# Altium schematic sheet 5_WG.SchDoc
size A3; DocumentNumber: 4; SheetNumber: 5; SheetTotal: 6
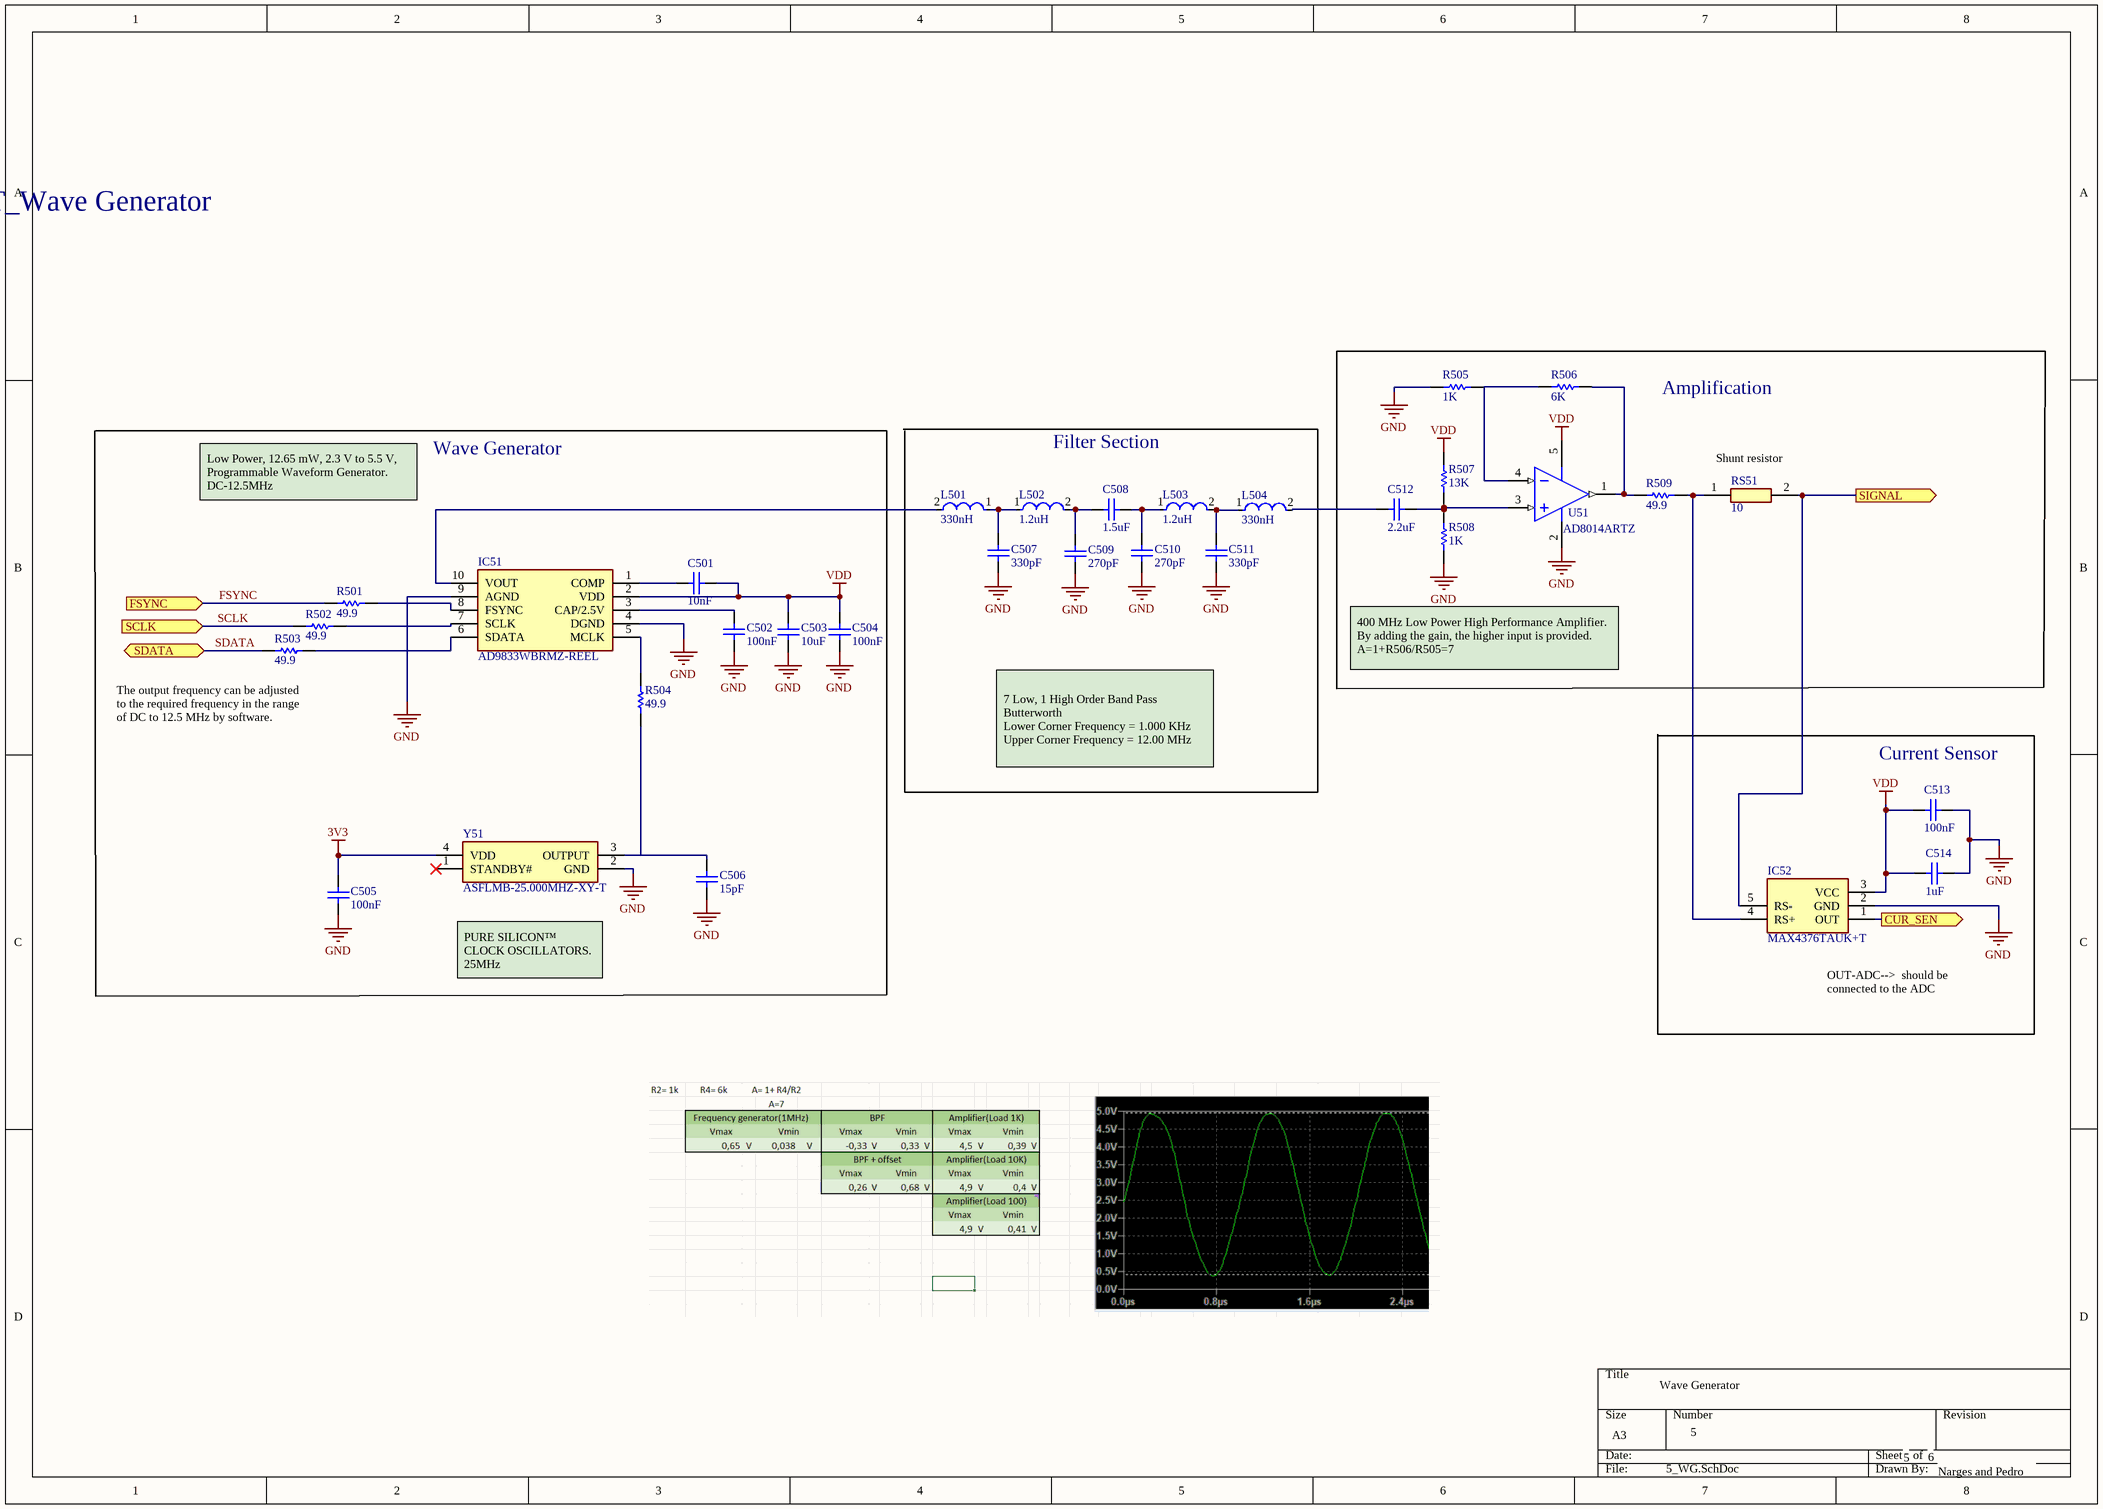
[diagram p0: 5_WG.SchDoc]

## Parts
C501  value 10nF  [CAPC1005X55X30LL05T10]  (hidden comment: generic)
C502  value 100nF  [CAPC1005X55X30LL05T10]  (hidden comment: generic)
C503  value 10uF  [FP-C0603C-CF-IPC_A]  (hidden comment: generic)
C504  value 100nF  [CAPC1005X55X30LL05T10]  (hidden comment: generic)
C505  value 100nF  [CAPC1005X55X30LL05T10]  (hidden comment: generic)
C506  value 15pF  [CAPC1005X55X30LL05T10]  (hidden comment: generic)
C507  value 330pF  [CAPC1005X55X30LL05T10]  (hidden comment: generic)
C508  value 1.5uF  [CAPC1005X55X30LL05T10]  (hidden comment: generic)
C509  value 270pF  [CAPC1005X55X30LL05T10]  (hidden comment: generic)
C510  value 270pF  [CAPC1005X55X30LL05T10]  (hidden comment: generic)
C511  value 330pF  [CAPC1005X55X30LL05T10]  (hidden comment: generic)
C512  value 2.2uF  [FP-C0603C-CF-IPC_A]  (hidden comment: generic)
C513  value 100nF  [CAPC1005X55X30LL05T10]  (hidden comment: generic)
C514  value 1uF  [CAPC1005X55X30LL05T10]  (hidden comment: generic)
IC51  AD9833WBRMZ-REEL  [ADI-RM-10_L]
IC52  MAX4376TAUK+T  [MAXM-U5+2_L]
L501  Inductance: 330nH  [IND_0402HL-821XJRU]  (hidden comment: LQW18AN10NG00D)
L502  Inductance: 1.2uH  [IND_0402HL-821XJRU]  (hidden comment: LQW18AN10NG00D)
L503  Inductance: 1.2uH  [IND_0402HL-821XJRU]  (hidden comment: LQW18AN10NG00D)
L504  Inductance: 330nH  [IND_0402HL-821XJRU]  (hidden comment: LQW18AN10NG00D)
R501  Resistance: 49.9  [RESC1608X55X25LL10T15]  (hidden comment: RC0603JR-070RL)
R502  Resistance: 49.9  [RESC1608X55X25LL10T15]  (hidden comment: RC0603JR-070RL)
R503  Resistance: 49.9  [RESC1608X55X25LL10T15]  (hidden comment: RC0603JR-070RL)
R504  Resistance: 49.9  [RESC1608X55X25LL10T15]  (hidden comment: RC0603JR-070RL)
R505  Resistance: 1K  [RESC1608X55X25LL10T15]  (hidden comment: RC0603JR-070RL)
R506  Resistance: 6K  [RESC1608X55X25LL10T15]  (hidden comment: RC0603JR-070RL)
R507  Resistance: 13K  [RESC1608X55X25LL10T15]  (hidden comment: RC0603JR-070RL)
R508  Resistance: 1K  [RESC1608X55X25LL10T15]  (hidden comment: RC0603JR-070RL)
R509  Resistance: 49.9  [RESC1608X55X25LL10T15]  (hidden comment: RC0603JR-070RL)
RS51  10  [RESC6331X80N]
U51  AD8014ARTZ  [ADI-RJ-5_L]
Y51  ASFLMB-25.000MHZ-XY-T  [FP-ASFL3-MFG]

## Blocks framed on the sheet
Amplification: C512 R505-R509 RS51 U51
Wave Generator: C501-C506 IC51 R501-R504 Y51
Filter Section: C507-C511 L501-L504
Current Sensor: C513 C514 IC52

## Ports
CUR_SEN (out, see 1_RPi[4B]), FSYNC (in, see 1_RPi[4B]), SCLK (in, see 1_RPi[4B]), SDATA (bidir, see 1_RPi[4B]), SIGNAL (out, see 1_RPi[4B])

## Nets
3V3: C505.2 Y51.4(VDD)
GND: C502.1 C503.2 C504.1 C505.1 C506.1 C507.2 C509.2 C510.1 C511.2 C513.2 C514.2 IC51.4(DGND) IC51.9(AGND) IC52.2(GND) R505.1 R508.1 U51.2(-VS) Y51.2(GND)
VDD: C501.1 C503.1 C504.2 C513.1 C514.1 IC51.2(VDD) IC52.3(VCC) R507.2 U51.5(+VS)
CUR_SEN: IC52.1(OUT) ; port CUR_SEN
FSYNC: R501.1 ; port FSYNC
SCLK: R502.1 ; port SCLK
SDATA: R503.1 ; port SDATA
SIGNAL: IC52.5(RS-) RS51.2 ; port SIGNAL
NetC501_2: C501.2 IC51.1(COMP)
NetC502_2: C502.2 IC51.3(CAP/2.5V)
NetC506_2: C506.2 R504.1 Y51.3(OUTPUT)
NetC507_1: C507.1 L501.1 L502.1
NetC508_1: C508.1 C510.2 L503.1
NetC508_2: C508.2 C509.1 L502.2
NetC511_1: C511.1 L503.2 L504.1
NetC512_1: C512.1 R507.1 R508.2 U51.3(+IN)
NetC512_2: C512.2 L504.2
NetIC51_5: IC51.5(MCLK) R504.2
NetIC51_6: IC51.6(SDATA) R503.2
NetIC51_7: IC51.7(SCLK) R502.2
NetIC51_8: IC51.8(FSYNC) R501.2
NetIC51_10: IC51.10(VOUT) L501.2
NetIC52_4: IC52.4(RS+) R509.2 RS51.1
NetR505_2: R505.2 R506.1 U51.4(-IN)
NetR506_2: R506.2 R509.1 U51.1(VOUT)

Not connected (* = marked no-connect by the designer): Y51 1(STANDBY#)*

## Notes on the sheet
- [5] 5_EIT_Wave Generator
- Low Power, 12.65 mW, 2.3 V to 5.5 V, Programmable Waveform Generator. DC-12.5MHz
- (near RS51) Shunt resistor
- 400 MHz Low Power High Performance Amplifier. By adding the gain, the higher input is provided.
  A=1+R506/R505=7
- (near R503) The output frequency can be adjusted to the required frequency in the range of DC to 12.5 MHz by software.
- 7 Low, 1 High Order Band Pass Butterworth
  Lower Corner Frequency = 1.000 KHz
  Upper Corner Frequency = 12.00 MHz
- (near Y51) PURE SILICON™ CLOCK OSCILLATORS.       25MHz
- (near IC52) OUT-ADC-->  should be connected to the ADC
- Wave Generator
- 5
- 6
- Narges and Pedro

## Library data of the parts
C501-C514 = Capacitor: Device Class L1: Passive Components; Device Class L2: Capacitors
IC51 = AD9833WBRMZ-REEL: Integrated Circuit; Manufacturer_Name: Analog Devices; Datasheet Link: https://componentsearchengine.com/Datasheets/1/AD9833WBRMZ-REEL.pdf; Height: 1.1mm; Manufacturer_Part_Number: AD9833WBRMZ-REEL; Mouser Part Number: 584-AD9833WBRMZ-REEL; Mouser Price/Stock: https://www.mouser.co.uk/ProductDetail/Analog-Devices/AD9833WBRMZ-REEL?qs=pqQDoYZ2quYFMaVwD82%2FEg%3D%3D; Arrow Part Number: AD9833WBRMZ-REEL; Arrow Price/Stock: https://www.arrow.com/en/products/ad9833wbrmz-reel/analog-devices?region=nac
IC52 = MAX4376TAUK+T: MAX4376 Series 28 V 2MHz Buffer Current Sense Operational Amplifier - SOT-23-5; Manufacturer_Name: Analog Devices; Manufacturer: Maxim; Min Supply Voltage: 3V; Max Supply Voltage: 28V; Slew Rate: 10V/µs; Common Mode Rejection Ratio: 90dB; Operating Supply Current: 1mA; Output Current per Channel: 2mA; Number of Circuits: 1; Input Bias Current: 800uA; Bandwidth: 1.7MHz; Max Supply Current: 2.2mA; Datasheet Link: https://pdfserv.maximintegrated.com/en/ds/MAX4376-MAX4378.pdf; Height: 1.45mm; Manufacturer_Part_Number: MAX4376TAUK+T; Mouser Part Number: 700-MAX4376TAUK+T; Mouser Price/Stock: https://www.mouser.co.uk/ProductDetail/Maxim-Integrated/MAX4376TAUK%2bT?qs=1eQvB6Dk1viezN1idOFyfw%3D%3D; Supplier: Mouser; Supplier Part Number: 700-MAX4376TAUK+T; Manufacturer Part Number: MAX4376TAUK+T; RoHS: Yes; Category: Amplifiers - Op Amps, Buffer, Instrumentation; Stock: 10809; Pricing: 1=2,84, 10=2,55, 50=2,41, 100=2,09, 1000=1,61, 10000=1,55 (USD); Case/Package: SOT-23-5; Pins: 5; Weight: 0.001058oz; Min Operating Temperature: -40°C; Max Operating Temperature: 125°C; Packaging: Tape and Reel; -3db Bandwidth: 2MHz; Package Quantity: 2500; Number of Amplifiers: 1; Series: MAX4376T; Length: 3mm; Width: 1.75mm; RoHS Compliant: Yes; Reach SVHC Compliant: Unknown; ComponentLink1URL: https://datasheet.ciiva.com/30481/0900766b8124c2e5-30481549.pdf?src-supplier=Rs; ComponentLink1Description: https://datasheet.ciiva.com/30481/0900766b8124c2e5-30481549.pdf?src-supplier=Rs; ComponentLink2URL: https://datasheet.ciiva.com/1802/max4376-max4378-1802098.pdf?src-supplier=Digi-Key; ComponentLink2Description: https://datasheet.ciiva.com/1802/max4376-max4378-1802098.pdf?src-supplier=Digi-Key; ComponentLink3URL: https://datasheet.ciiva.com/1802/max4376-max4378-1802099.pdf?src-supplier=Digi-Key; ComponentLink3Description: https://datasheet.ciiva.com/1802/max4376-max4378-1802099.pdf?src-supplier=Digi-Key; ComponentLink4URL: https://datasheet.ciiva.com/2976/max4376-max4378-2976259.pdf?src-supplier=Avnet; ComponentLink4Description: https://datasheet.ciiva.com/2976/max4376-max4378-2976259.pdf?src-supplier=Avnet; ComponentLink5URL: https://datasheet.ciiva.com/1802/max4376-max4378-1802100.pdf?src-supplier=Digi-Key; ComponentLink5Description: https://datasheet.ciiva.com/1802/max4376-max4378-1802100.pdf?src-supplier=Digi-Key; Supplier 1: Mouser; Supplier Part Number 1: 700-MAX4376TAUK+T
L501-L504 = 725321dda6339637d4d059423bc1c3c: Wire Wound RF Inductor 10nH ±2% 650mA 0.11Ω 0603 (1608); DC Resistance (DCR): 110mR; Q Factor: 35; Shielding: Unshielded; Test Frequency: 100MHz; Current: 550mA; Self Resonant Frequency: 6GHz; Radiation Hardening: No; Depth: 1mm; Case Code (Imperial): 0603; Inductance Tolerance: 2%; Series: LQW18A_00; Tolerance: 2%; Weight: 0.000106oz; Rated Current-Max: 650mA; Mount: Surface Mount; Series Resistance: 110mR; REACH SVHC: No SVHC; Current Rating: 650mA; Case Code (Metric): 1608; Lead Free: Lead Free; Resistor Type: Wirewound; Package Quantity: 4000; Termination: SMD/SMT; DC Current: 650mA; Height: 0.8mm; Min Operating Temperature: -55°C; Military Standard: Not; Max Operating Temperature: 125°C; Max DC Current: 650mA; Case/Package: 0603; Number of Pins: 2; Packaging: Tape and Reel; Width: 0.8mm; Length: 1.6mm
R501-R509 = RES-2: Chip Resistor, 0 Ohm, +/- 5%, 0.1 W, -55 to 155 degC, 0603 (1608 Metric), RoHS, Tape and Reel; Manufacturer: Yageo; Temperature Coefficient: 200ppm/degreesC; Voltage Rating: 50V; Power Rating: 100mW; Width: 0.8mm; Max Operating Temperature: 155degC; Tolerance: 5%; Package Reference: 0603; Height: 0.45mm; Depth: 0.8mm; Package Description: 2-Pin Surface Mount Device, Body 1.6 x 0.8 mm; Termination: SMD/SMT; Package Quantity: 5000; Case/Package: 0603; Case Code (Imperial): 0603; Radiation Hardening: No; Number of Pins: 2; Length: 1.6mm; Lead Free: LeadFree; Voltage Rating (DC): 50V; Military Standard: Not; Datasheet URL: http://www.yageo.com/NewPortal/yageodocoutput?fileName=/pdf/R-Chip/PYu-RC_Group_51_RoHS_L_5.pdf; Manufacturer URL: http://www.yageo.com/; Packaging: TapeandReel; Case Code (Metric): 1608; Min Operating Temperature: -55degC; Composition: ThickFilm; RoHSCompliant: true; Contact Plating: Tin; Datasheet Version: Rev. 5, 10/2016; REACH SVHC: NoSVHC
RS51 = CRM2512AFX-10R0ELF: Res Thick Film 2512 10 Ohm 1% 2W ±100ppm/°C Molded SMD SMD Paper T/R; Manufacturer_Name: Bourns; Datasheet Link: http://www.bourns.com/data/global/pdfs/CRM0805_1206_2010.pdf; Height: 0.8mm; Manufacturer_Part_Number: CRM2512AFX-10R0ELF; Mouser Part Number: 652-CRM2512AFX10R0LF; Mouser Price/Stock: https://www.mouser.co.uk/ProductDetail/Bourns/CRM2512AFX-10R0ELF?qs=wd5RIQLrsJh9GcgTtlCG0w%3D%3D; Arrow Part Number: CRM2512AFX-10R0ELF; Arrow Price/Stock: https://www.arrow.com/en/products/crm2512afx-10r0elf/bourns; Supplier: Farnell; Supplier Part Number: 2824741; Manufacturer: Bourns; Manufacturer Part Number: CRM2512AFX-10R0ELF; RoHS: No; Category: Chip SMD Resistors; Stock: 3780; Pricing: 10=0,395, 100=0,312, 500=0,244, 1000=0,209, 2000=0,202 (EUR); ComponentLink1URL: http://www.farnell.com/datasheets/2552937.pdf?src-supplier=Farnell; ComponentLink1Description: http://www.farnell.com/datasheets/2552937.pdf?src-supplier=Farnell; ComponentLink2URL: http://www.farnell.com/datasheets/2552937.pdf?src-supplier=Newark; ComponentLink2Description: http://www.farnell.com/datasheets/2552937.pdf?src-supplier=Newark; ComponentLink3URL: http://www.bourns.com/docs/product-datasheets/crm-a.pdf?src-supplier=Digi-Key; ComponentLink3Description: http://www.bourns.com/docs/product-datasheets/crm-a.pdf?src-supplier=Digi-Key; ComponentLink4URL: https://www.bourns.com/docs/product-datasheets/crm-a.pdf?src-supplier=Digi-Key; ComponentLink4Description: https://www.bourns.com/docs/product-datasheets/crm-a.pdf?src-supplier=Digi-Key; ComponentLink5URL: https://datasheet.octopart.com/CRM2512AFX-10R0ELF-Bourns-datasheet-99878395.pdf?src-supplier=Master+Electronics; ComponentLink5Description: https://datasheet.octopart.com/CRM2512AFX-10R0ELF-Bourns-datasheet-99878395.pdf?src-supplier=Master+Electronics; ComponentLink6URL: https://datasheet.ciiva.com/6550/crm-6550127.pdf?src-supplier=Digi-Key; ComponentLink6Description: https://datasheet.ciiva.com/6550/crm-6550127.pdf?src-supplier=Digi-Key; ComponentLink7URL: https://datasheet.ciiva.com/9122/crm-9122397.pdf?src-supplier=Avnet; ComponentLink7Description: https://datasheet.ciiva.com/9122/crm-9122397.pdf?src-supplier=Avnet; Supplier 1: Farnell; Supplier Part Number 1: 2824741
U51 = ADI-AD80XX-5: Single Channel Very Low Noise Operational Amplifier, 400 MHz BW, 4 KV/us SR, Industrial, 5-pin SOT23 (RJ-5), Reel; Manufacturer: Analog Devices; Generic Part Number: AD8014; PartNumber: AD8014ARTZ-REEL7; Amplifiers Per Package: 1; Input Bias Current: 5uA; V Span Min: 4.5V; Small Signal Bandwidth: 400MHz; V Span Max: 12V; Iq/Amp: 1.3mA; Slew Rate: 4KV/us; Input Offset Voltage: 2mV; DatasheetVersion: Rev. C; ComponentLink1Description: Manufacturer URL; PackageVersion: 121608-A; PackageReference: RJ-5; ComponentLink1URL: http://www.analog.com/en/index.html; PackageDescription: 5-Pin Small Outline Transistor Package, Body 2.9 x 1.6 mm, Pitch 0.95 mm; ComponentLink2Description: Datasheet; RevisionNote: Symbol corrected, Pin 2 orientation reversed; ComponentLink2URL: http://www.analog.com/static/imported-files/data_sheets/AD8014.pdf; Mounting Technology: Surface Mount; ComponentLink3Description: Package Specification; Code_JEDEC: MO-178-AA; ComponentLink3URL: http://www.analog.com/static/imported-files/packages/PKG_PDF/SOT-23(RJ)/RJ_5.pdf
Y51 = ASFLMB-25.000MHZ-XY-T: Crystal or Oscillator; Manufacturer_Name: ABRACON; Datasheet Link: https://abracon.com/Oscillators/ASFLMB.pdf; Height: 0.9mm; Manufacturer_Part_Number: ASFLMB-25.000MHZ-XY-T; Mouser Part Number: 815-ASFLMB-25-XY-T; Mouser Price/Stock: https://www.mouser.co.uk/ProductDetail/ABRACON/ASFLMB-25.000MHZ-XY-T?qs=CnD89xF1VSmONT2LProkzQ%3D%3D; Arrow Part Number: ASFLMB-25.000MHZ-XY-T; Arrow Price/Stock: https://www.arrow.com/en/products/asflmb-25.000mhz-xy-t/abracon